# EAGLE design M304B (EAGLE 6.6.0)
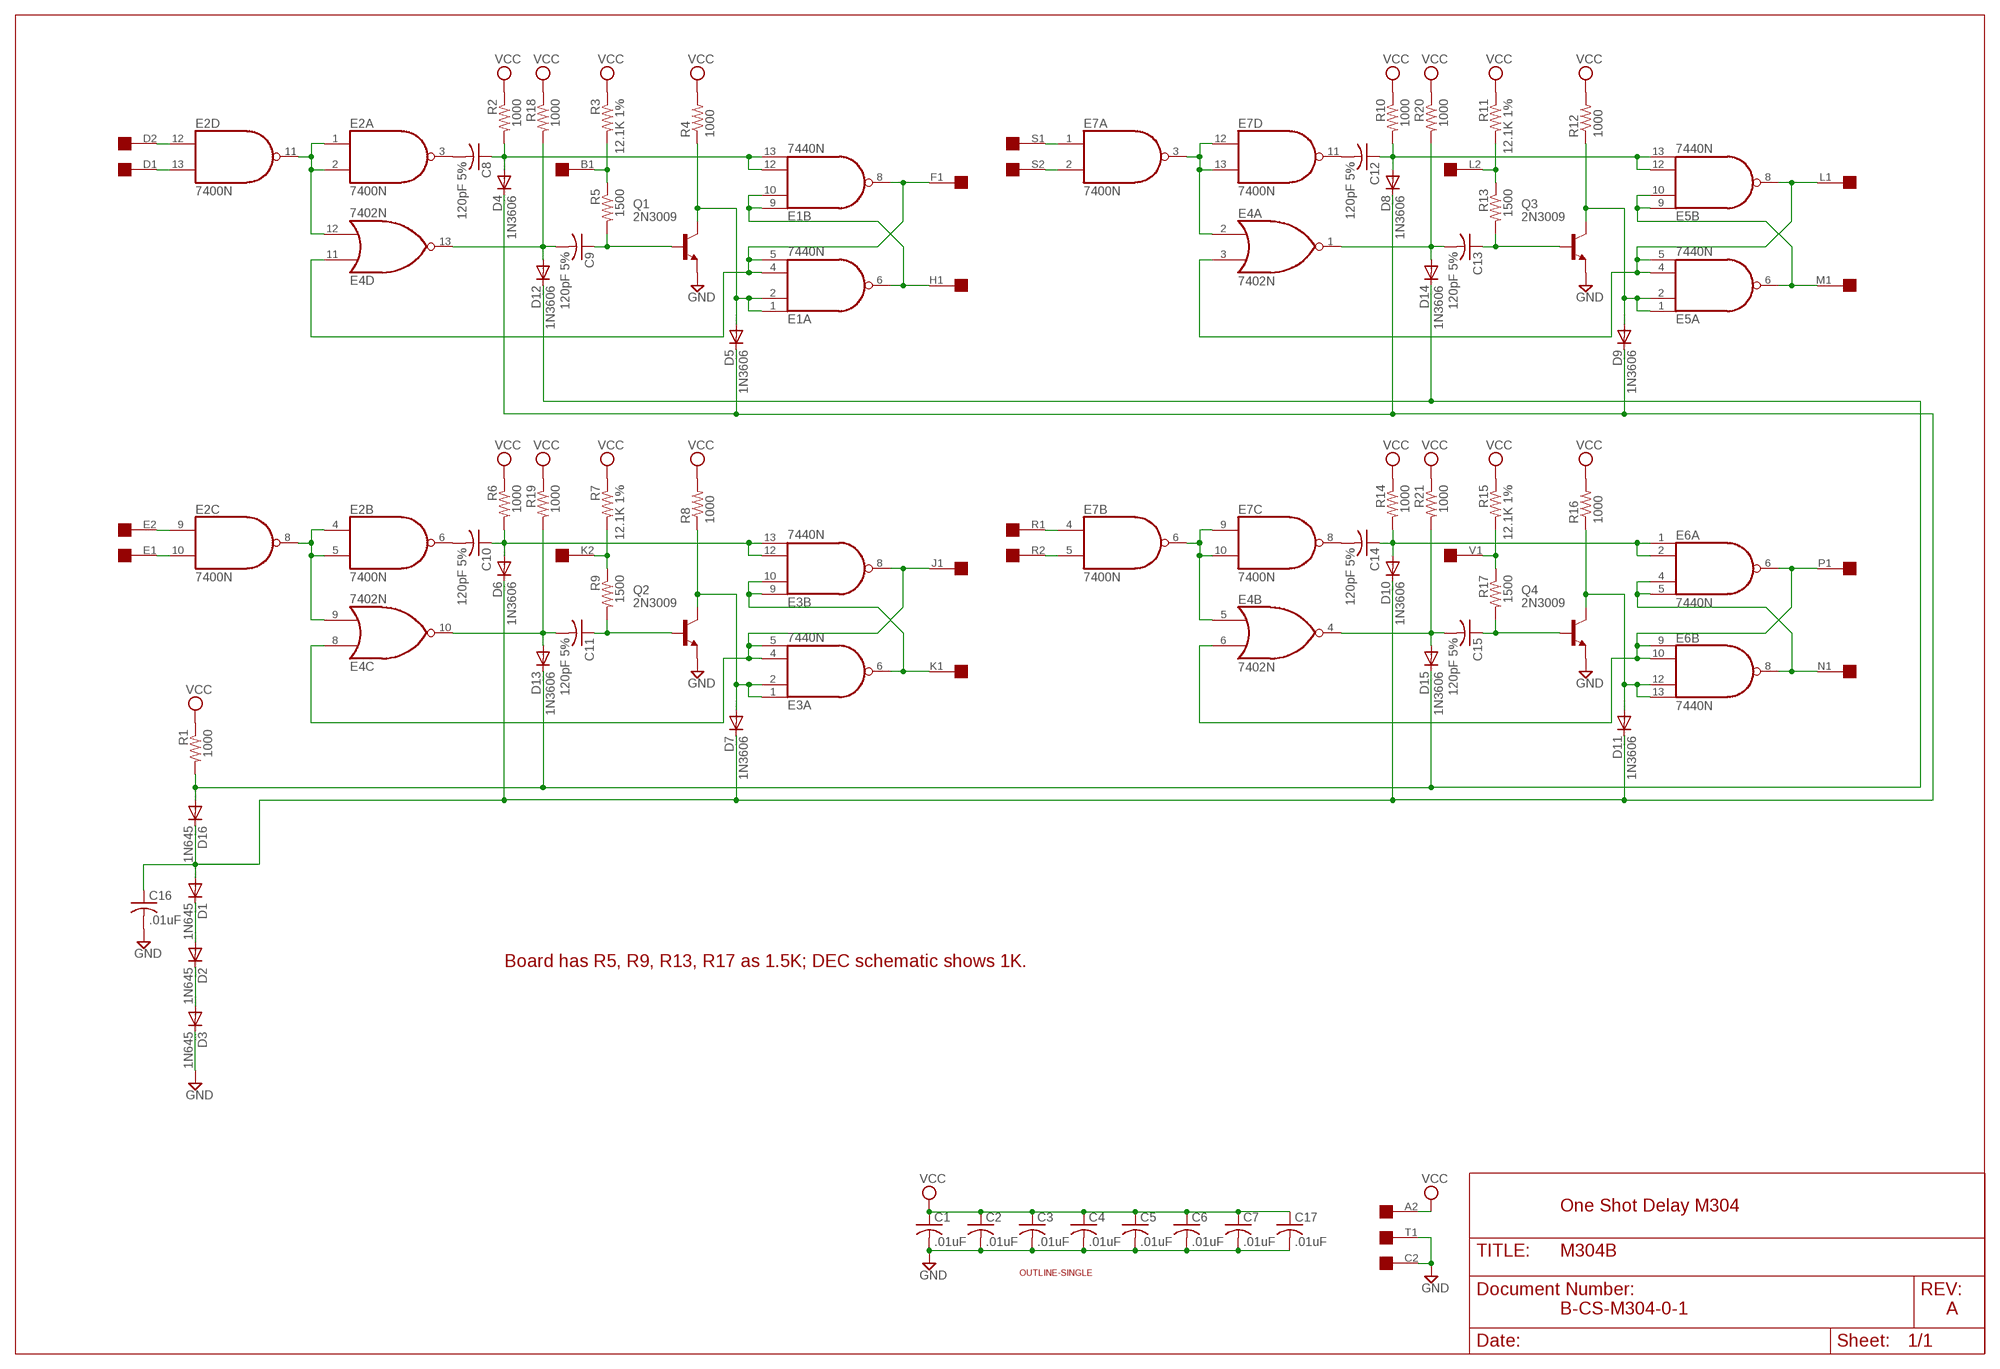
[diagram p0: schematic, sheet 1]

## Parts
C1  .01uF  C-US050-025X075  [C050-025X075]
C2  .01uF  C-US050-025X075  [C050-025X075]
C3  .01uF  C-US050-025X075  [C050-025X075]
C4  .01uF  C-US050-025X075  [C050-025X075]
C5  .01uF  C-US050-025X075  [C050-025X075]
C6  .01uF  C-US050-025X075  [C050-025X075]
C7  .01uF  C-US050-025X075  [C050-025X075]
C8  120pF 5%  C-US050-025X075  [C050-025X075]
C9  120pF 5%  C-US050-025X075  [C050-025X075]
C10  120pF 5%  C-US050-025X075  [C050-025X075]
C11  120pF 5%  C-US050-025X075  [C050-025X075]
C12  120pF 5%  C-US050-025X075  [C050-025X075]
C13  120pF 5%  C-US050-025X075  [C050-025X075]
C14  120pF 5%  C-US050-025X075  [C050-025X075]
C15  120pF 5%  C-US050-025X075  [C050-025X075]
C16  .01uF  C-US050-025X075  [C050-025X075]
C17  .01uF  C-US050-025X075  [C050-025X075]
D1  1N645  1N4148DO35-10  [DO35-10]
D2  1N645  1N4148DO35-10  [DO35-10]
D3  1N645  1N4148DO35-10  [DO35-10]
D4  1N3606  1N4148DO35-10  [DO35-10]
D5  1N3606  1N4148DO35-10  [DO35-10]
D6  1N3606  1N4148DO35-10  [DO35-10]
D7  1N3606  1N4148DO35-10  [DO35-10]
D8  1N3606  1N4148DO35-10  [DO35-10]
D9  1N3606  1N4148DO35-10  [DO35-10]
D10  1N3606  1N4148DO35-10  [DO35-10]
D11  1N3606  1N4148DO35-10  [DO35-10]
D12  1N3606  1N4148DO35-10  [DO35-10]
D13  1N3606  1N4148DO35-10  [DO35-10]
D14  1N3606  1N4148DO35-10  [DO35-10]
D15  1N3606  1N4148DO35-10  [DO35-10]
D16  1N645  1N4148DO35-10  [DO35-10]
E1  7440N  74S20N  [DIL14]
E2  7400N  [DIL14]
E3  7440N  74S20N  [DIL14]
E4  7402N  [DIL14]
E5  7440N  74S20N  [DIL14]
E6  7440N  74S20N  [DIL14]
E7  7400N  [DIL14]
Q1  2N3009  2N3019-NPN-TO39-EBC  [TO39]
Q2  2N3009  2N3019-NPN-TO39-EBC  [TO39]
Q3  2N3009  2N3019-NPN-TO39-EBC  [TO39]
Q4  2N3009  2N3019-NPN-TO39-EBC  [TO39]
R1  1000  R-US_0207/10  [0207/10]
R2  1000  R-US_0207/10  [0207/10]
R3  12.1K 1%  R-US_0207/15  [0207/15]
R4  1000  R-US_0207/10  [0207/10]
R5  1500  R-US_0207/10  [0207/10]
R6  1000  R-US_0207/10  [0207/10]
R7  12.1K 1%  R-US_0207/15  [0207/15]
R8  1000  R-US_0207/10  [0207/10]
R9  1500  R-US_0207/10  [0207/10]
R10  1000  R-US_0207/10  [0207/10]
R11  12.1K 1%  R-US_0207/15  [0207/15]
R12  1000  R-US_0207/10  [0207/10]
R13  1500  R-US_0207/10  [0207/10]
R14  1000  R-US_0207/10  [0207/10]
R15  12.1K 1%  R-US_0207/15  [0207/15]
R16  1000  R-US_0207/10  [0207/10]
R17  1500  R-US_0207/10  [0207/10]
R18  1000  R-US_0207/10  [0207/10]
R19  1000  R-US_0207/10  [0207/10]
R20  1000  R-US_0207/10  [0207/10]
R21  1000  R-US_0207/10  [0207/10]
U$1  SINGLE  [EDGE-CON2]
U$2  OUTLINE-SINGLE  [SINGLE]

## Nets
GND [power]: C1.2 C2.2 C3.2 C4.2 C5.2 C6.2 C7.2 C16.2 C17.2 D3.C Q1.1(E) Q2.1(E) Q3.1(E) Q4.1(E) U$1.C2 U$1.T1
N$1: C16.1 D1.A D4.C D5.C D6.C D7.C D8.C D9.C D10.C D11.C D16.C
N$2: D5.A E1.1(A:I0) E1.2(A:I1) Q1.3(C) R4.1
N$3: E2.1(A:I0) E2.2(A:I1) E2.11(D:O) E4.12(D:I1)
N$4: E2.13(D:I1) U$1.D1
N$5: D1.C D2.A
N$6: E2.12(D:I0) U$1.D2
N$7: C8.2 E2.3(A:O)
N$8: C8.1 D4.A E1.12(B:I2) E1.13(B:I3) R2.2
N$9: D2.C D3.A
N$10: C9.2 D12.A E4.13(D:O) R18.2
N$11: C9.1 Q1.2(B) R5.2
N$12: R3.2 R5.1 U$1.B1
N$13: E1.4(A:I2) E1.5(A:I3) E1.8(B:O) E4.11(D:I0) U$1.F1
N$14: E1.6(A:O) E1.9(B:I0) E1.10(B:I1) U$1.H1
N$16: D12.C D13.C D14.C D15.C D16.A R1.2
N$17: D7.A E3.1(A:I0) E3.2(A:I1) Q2.3(C) R8.1
N$18: E2.4(B:I0) E2.5(B:I1) E2.8(C:O) E4.9(C:I1)
N$19: E2.9(C:I0) U$1.E2
N$20: E2.10(C:I1) U$1.E1
N$21: C10.2 E2.6(B:O)
N$22: C10.1 D6.A E3.12(B:I2) E3.13(B:I3) R6.2
N$23: C11.2 D13.A E4.10(C:O) R19.2
N$24: C11.1 Q2.2(B) R9.2
N$25: R7.2 R9.1 U$1.K2
N$26: E3.4(A:I2) E3.5(A:I3) E3.8(B:O) E4.8(C:I0) U$1.J1
N$27: E3.6(A:O) E3.9(B:I0) E3.10(B:I1) U$1.K1
N$29: D9.A E5.1(A:I0) E5.2(A:I1) Q3.3(C) R12.1
N$30: E4.2(A:I0) E7.3(A:O) E7.12(D:I0) E7.13(D:I1)
N$31: E7.1(A:I0) U$1.S1
N$32: E7.2(A:I1) U$1.S2
N$33: C12.2 E7.11(D:O)
N$34: C12.1 D8.A E5.12(B:I2) E5.13(B:I3) R10.2
N$35: C13.2 D14.A E4.1(A:O) R20.2
N$36: C13.1 Q3.2(B) R13.2
N$37: R11.2 R13.1 U$1.L2
N$38: E4.3(A:I1) E5.4(A:I2) E5.5(A:I3) E5.8(B:O) U$1.L1
N$39: E5.6(A:O) E5.9(B:I0) E5.10(B:I1) U$1.M1
N$41: D11.A E6.12(B:I2) E6.13(B:I3) Q4.3(C) R16.1
N$42: E4.5(B:I0) E7.6(B:O) E7.9(C:I0) E7.10(C:I1)
N$43: E7.4(B:I0) U$1.R1
N$44: E7.5(B:I1) U$1.R2
N$45: C14.2 E7.8(C:O)
N$46: C14.1 D10.A E6.1(A:I0) E6.2(A:I1) R14.2
N$47: C15.2 D15.A E4.4(B:O) R21.2
N$48: C15.1 Q4.2(B) R17.2
N$49: R15.2 R17.1 U$1.V1
N$50: E4.6(B:I1) E6.6(A:O) E6.9(B:I0) E6.10(B:I1) U$1.P1
N$51: E6.4(A:I2) E6.5(A:I3) E6.8(B:O) U$1.N1
VCC [power]: C1.1 C2.1 C3.1 C4.1 C5.1 C6.1 C7.1 C17.1 R1.1 R2.1 R3.1 R4.2 R6.1 R7.1 R8.2 R10.1 R11.1 R12.2 R14.1 R15.1 R16.2 R18.1 R19.1 R20.1 R21.1 U$1.A2
Unconnected: U$1.A1 U$1.B2 U$1.C1 U$1.F2 U$1.H2 U$1.J2 U$1.M2 U$1.N2 U$1.P2 U$1.T2 U$1.U1 U$1.U2 U$1.V2

## Notes on the sheet
- Board has R5, R9, R13, R17 as 1.5K; DEC schematic shows 1K.
- One Shot Delay M304
- B-CS-M304-0-1 | A

## Power pins joined to a net without a drawn wire
GND: E1.7(P:GND) E2.7(P:GND) E3.7(P:GND) E4.7(P:GND) E5.7(P:GND) E6.7(P:GND) E7.7(P:GND)
VCC: E1.14(P:VCC) E2.14(P:VCC) E3.14(P:VCC) E4.14(P:VCC) E5.14(P:VCC) E6.14(P:VCC) E7.14(P:VCC)

## Library data of the parts
C1-C17 = rcl:C-US: CAPACITOR, American symbol
D1-D16 = diode:1N4148: DIODE high speed (Philips)
E1 E3 E5 E6 = 74xx-us:74*20: Dual 4-input NAND gate
E2 E7 = 74xx-us:74*00: Quad 2-input NAND gate
E4 = 74xx-us:74*02: Quad 2-input NOR gate
Q1-Q4 = transistor:*-NPN-: NPN Transistror BF959 corrected 2008.03.06
R1-R21 = rcl:R-US_: RESISTOR, American symbol
U$1 = dec-con:SINGLE: Single-Height DEC board
U$2 = dec-con:OUTLINE-*: Board outlines for DEC boards.

## Net classes
1 power: width 0.813 mm

## Board
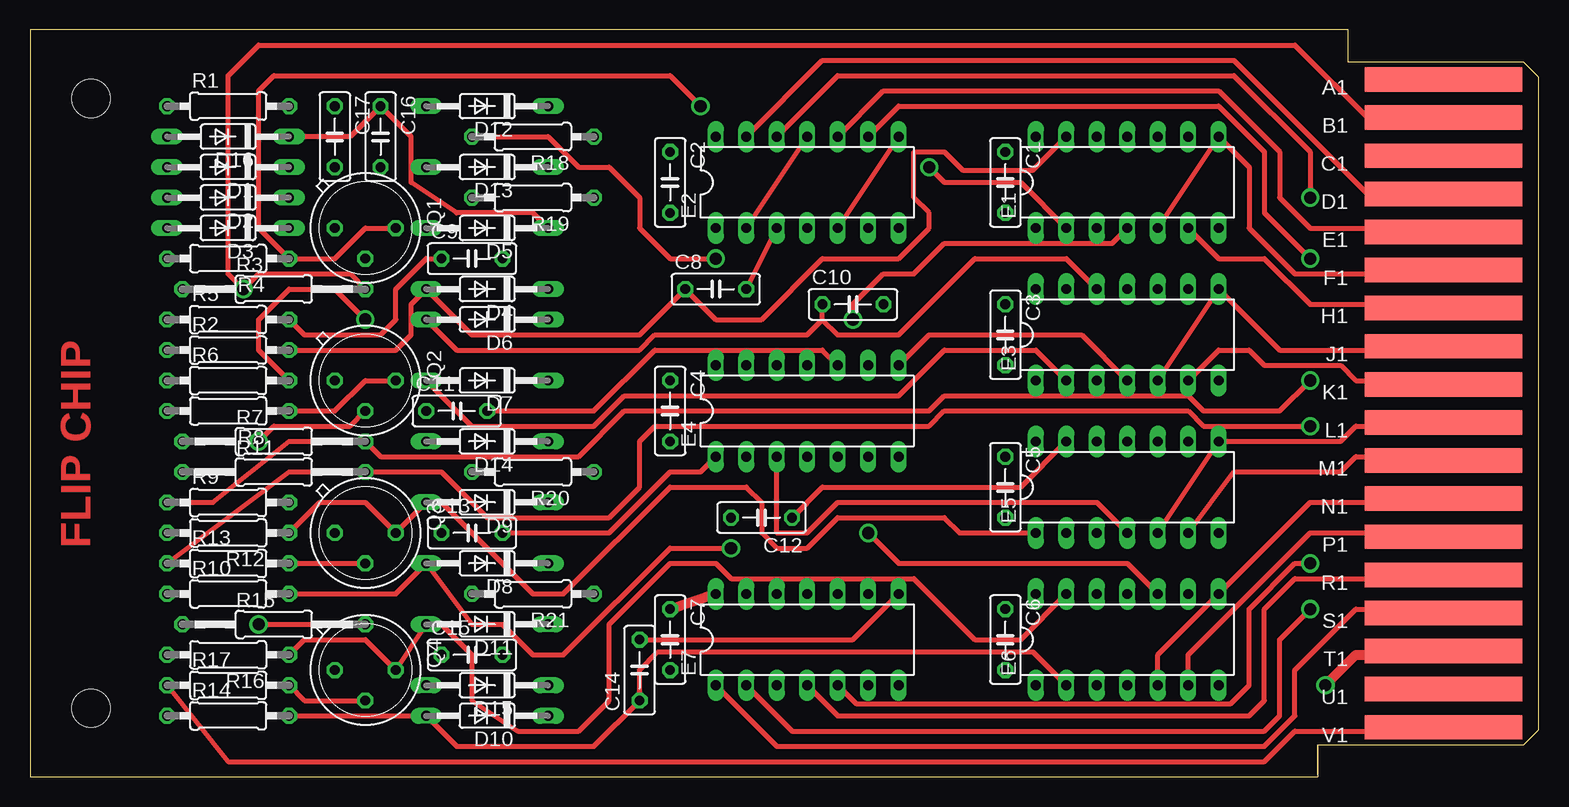
[diagram p1: board, top side]
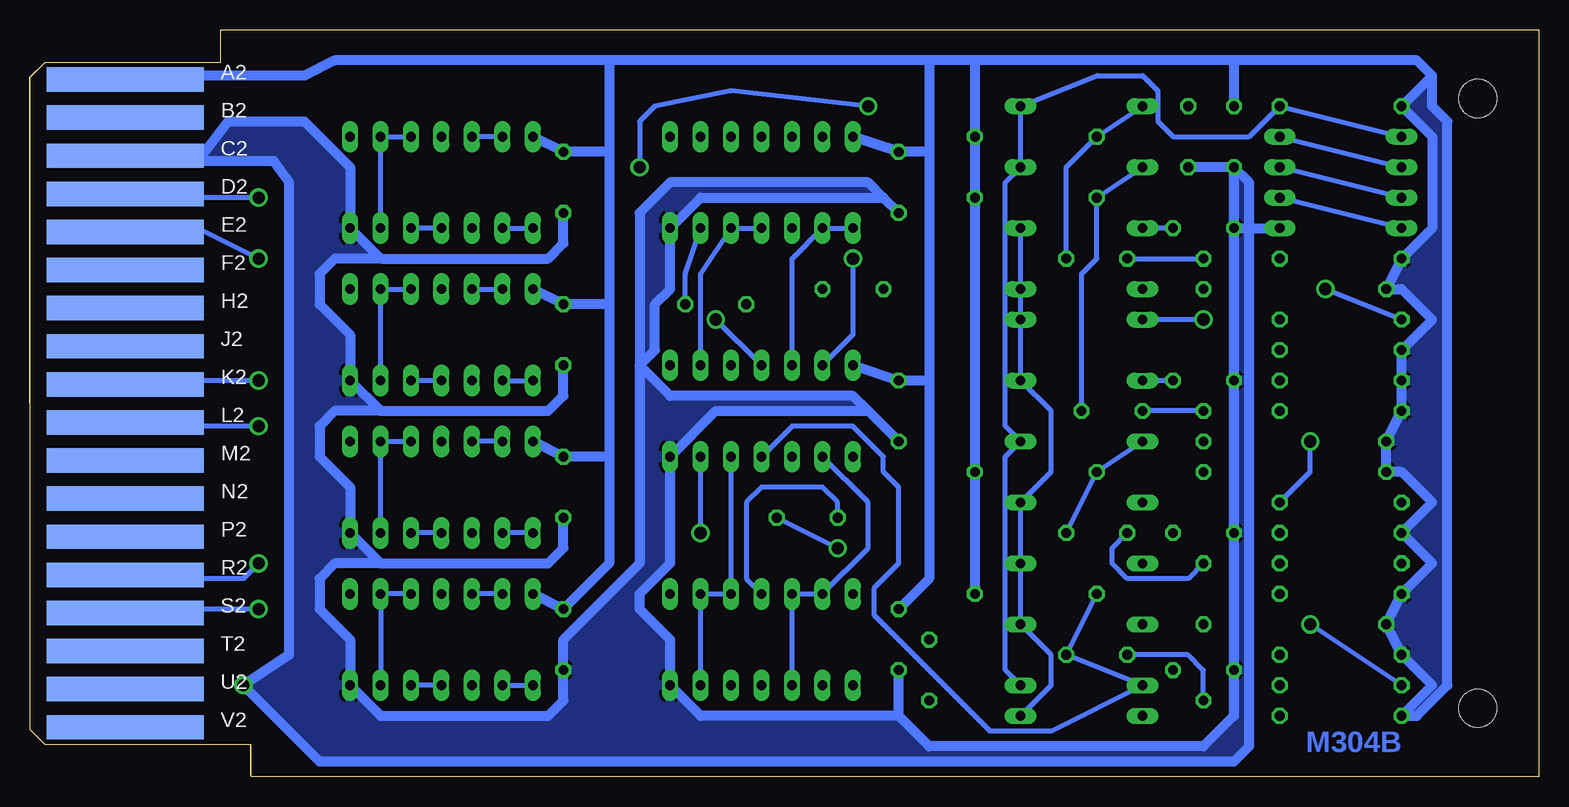
[diagram p2: board, bottom side, seen from below]

Size 125.73 x 62.23 mm. Coordinates in mm from the lower left corner, seen from the top.
Copper layers (1+16): Top 0.035mm / dielectric 1.5mm / Bottom 0.035mm
Design rules "16mils": minimum track width 16mil, minimum drill 32mil, track to track 15mil, track to pad 10mil, pad to pad 10mil, via to via 10mil, smd to smd 10mil, copper to edge 13mil, drill to drill 10mil, minimum pad ring 10mil, minimum via ring 8mil, stop-mask expansion 0mil, vias tented up to drill 0mil, thermal gap 10mil

### Footprints (pad centres in the part's own frame; a part is rotated, then mirrored left to right if it is on the bottom)
C050-025X075 = drill 0.813 octagon: 1 -2.54,0; 2 2.54,0
DO35-10 = drill 0.813 long: A 5.08,0; C -5.08,0
DIL14 = drill 0.813 long: 1 -7.62,-3.81; 2 -5.08,-3.81; 3 -2.54,-3.81; 4 0,-3.81; 5 2.54,-3.81; 6 5.08,-3.81; 7 7.62,-3.81; 8 7.62,3.81; 9 5.08,3.81; 10 2.54,3.81; 11 0,3.81; 12 -2.54,3.81; 13 -5.08,3.81; 14 -7.62,3.81
TO39 = drill 0.813 octagon: 1 0,-2.54; 2 2.54,0; 3 0,2.54
0207/10 = drill 0.813 octagon: 1 -5.08,0; 2 5.08,0
0207/15 = drill 0.813 octagon: 1 -7.62,0; 2 7.62,0
EDGE-CON2 = smd 13.106 x 2.032: A1 7.938,4.128; B1 7.938,7.303; C1 7.938,10.477; D1 7.938,13.652; E1 7.938,16.828; F1 7.938,20.003; H1 7.938,23.177; J1 7.938,26.352; K1 7.938,29.527; L1 7.938,32.703; M1 7.938,35.877; N1 7.938,39.053; P1 7.938,42.227; R1 7.938,45.403; S1 7.938,48.578; T1 7.938,51.752; U1 7.938,54.928; V1 7.938,58.102 | smd 13.106 x 2.032 bottom: A2 7.938,4.128; B2 7.938,7.303; C2 7.938,10.477; D2 7.938,13.652; E2 7.938,16.828; F2 7.938,20.003; H2 7.938,23.177; J2 7.938,26.352; K2 7.938,29.527; L2 7.938,32.703; M2 7.938,35.877; N2 7.938,39.053; P2 7.938,42.227; R2 7.938,45.403; S2 7.938,48.578; T2 7.938,51.752; U2 7.938,54.928; V2 7.938,58.102
SINGLE = hole 3.175: 120.65,56.515; 120.65,5.715

### Placement (x,y rotation side)
C1  81.28,49.53 270 top
C2  53.34,49.53 270 top
C3  81.28,36.83 270 top
C4  53.34,30.48 270 top
C5  81.28,24.13 270 top
C6  81.28,11.43 270 top
C7  53.34,11.43 270 top
C8  57.15,40.64 0 top
C9  36.83,43.18 0 top
C10  68.58,39.37 0 top
C11  35.56,30.48 0 top
C12  60.96,21.59 180 top
C13  36.83,20.32 0 top
C14  50.8,8.89 90 top
C15  36.83,10.16 0 top
C16  29.21,53.34 270 top
C17  25.4,53.34 270 top
D1  16.51,50.8 180 top
D2  16.51,48.26 180 top
D3  16.51,45.72 180 top
D4  38.1,40.64 180 top
D5  38.1,45.72 180 top
D6  38.1,38.1 180 top
D7  38.1,33.02 180 top
D8  38.1,17.78 180 top
D9  38.1,22.86 180 top
D10  38.1,5.08 180 top
D11  38.1,12.7 180 top
D12  38.1,55.88 180 top
D13  38.1,50.8 180 top
D14  38.1,27.94 180 top
D15  38.1,7.62 180 top
D16  16.51,53.34 180 top
E1  91.44,49.53 0 top
E2  64.77,49.53 0 top
E3  91.44,36.83 0 top
E4  64.77,30.48 0 top
E5  91.44,24.13 0 top
E6  91.44,11.43 0 top
E7  64.77,11.43 0 top
Q1  27.94,45.72 270 top
Q2  27.94,33.02 270 top
Q3  27.94,20.32 270 top
Q4  27.94,8.89 270 top
R1  16.51,55.88 0 top
R2  16.51,35.56 0 top
R3  20.32,40.64 0 top
R4  16.51,43.18 180 top
R5  16.51,38.1 0 top
R6  16.51,33.02 0 top
R7  20.32,27.94 0 top
R8  16.51,30.48 180 top
R9  16.51,22.86 0 top
R10  16.51,15.24 0 top
R11  20.32,25.4 0 top
R12  16.51,20.32 180 top
R13  16.51,17.78 0 top
R14  16.51,5.08 0 top
R15  20.32,12.7 0 top
R16  16.51,10.16 180 top
R17  16.51,7.62 0 top
R18  41.91,53.34 180 top
R19  41.91,48.26 180 top
R20  41.91,25.4 180 top
R21  41.91,15.24 180 top
U$1  125.73,62.23 180 top
U$2  125.73,62.23 180 top
U$3  [FLIPCHIP]  0,0 0 top

### Tracks (layer width: path | path; a pad name or v marks a point on that pad's centre or on a via)
GND  (via drill 1.02)
  Top 0.813: U$1.T1 116.84,10.16 111.76,10.16 110.49,10.16 v107.95,7.62
  Bottom 0.813: C17.2 C16.2 | C17.2 Q1.1 | Q1.1 Q2.1 Q3.1 Q4.1 25.4,5.08 27.94,2.54 50.8,2.54 53.34,5.08 | 53.34,5.08 C7.2 | 53.34,5.08 69.85,5.08 E7.7 72.39,11.43 74.93,13.97 74.93,15.24 72.39,17.78 E4.7 68.58,30.48 55.88,30.48 | U$1.C2 116.84,52.07 111.76,51.31 | 111.76,51.31 109.22,54.61 102.87,54.61 99.06,50.8 E1.7 96.52,43.18 | C1.2 81.28,44.45 82.55,43.18 96.52,43.18 | 96.52,43.18 100.33,43.18 101.6,41.91 101.6,39.37 99.06,36.83 E3.7 96.52,30.48 | C3.2 81.28,31.75 82.55,30.48 96.52,30.48 | C5.2 81.28,19.05 82.55,17.78 96.52,17.78 | 96.52,17.78 E5.7 99.06,24.13 101.6,26.67 101.6,29.21 100.33,30.48 96.52,30.48 | 96.52,17.78 100.33,17.78 101.6,16.51 101.6,13.97 99.06,11.43 E6.7 96.52,5.08 82.55,5.08 81.28,6.35 C6.2 81.28,11.43 74.93,17.78 74.93,46.99 72.39,49.53 55.88,49.53 54.61,48.26 | 54.61,48.26 C2.2 | 55.88,30.48 C4.2 | 55.88,30.48 57.15,31.75 72.39,31.75 74.93,34.29 73.66,35.56 73.66,39.37 72.39,40.64 E2.7 69.85,48.26 54.61,48.26 | C17.2 24.13,49.53 24.13,2.54 25.4,1.27 101.6,1.27 v107.95,7.62 104.14,10.16 104.14,49.53 105.41,51.31 111.76,51.31 | Q1.1 D3.C
  pour Bottom (isolate 0.305): 25.4,50.8 24.13,49.53 24.13,2.54 25.4,1.27 101.6,1.27 107.95,7.62 104.14,10.16 104.14,49.53 105.41,51.31 111.76,51.31 109.22,54.61 102.87,54.61 99.06,50.8 99.06,45.72 96.52,43.18 100.33,43.18 101.6,41.91 101.6,39.37 99.06,36.83 99.06,33.02 96.52,30.48 100.33,30.48 101.6,29.21 101.6,26.67 99.06,24.13 99.06,20.32 96.52,17.78 100.33,17.78 101.6,16.51 101.6,13.97 99.06,11.43 99.06,7.62 96.52,5.08 82.55,5.08 81.28,6.35 81.28,11.43 74.93,17.78 74.93,34.29 72.39,31.75 57.15,31.75 55.88,30.48 68.58,30.48 72.39,26.67 72.39,17.78 74.93,15.24 74.93,13.97 72.39,11.43 72.39,7.62 69.85,5.08 53.34,5.08 50.8,2.54 27.94,2.54 25.4,5.08
  pour Bottom (isolate 0.305): 54.61,48.26 55.88,49.53 72.39,49.53 74.93,46.99 74.93,34.29 73.66,35.56 73.66,39.37 72.39,40.64 72.39,45.72 69.85,48.26
N$1
  Top 0.406: D16.C 26.67,53.34 C16.1 31.75,53.34 31.75,49.53 35.56,46.99 41.91,46.99 D5.C
  Bottom 0.406: D16.C D1.A | D10.C 40.64,7.62 40.64,10.16 D11.C D8.C D9.C 40.64,25.4 40.64,30.48 D7.C D6.C D4.C D5.C
N$2  (via drill 1.02)
  Top 0.406: Q1.3 27.94,45.72 25.4,43.18 R4.1 19.05,45.72 19.05,57.15 20.32,58.42 53.34,58.42 v55.88,55.88 | v74.93,50.8 76.2,49.53 82.55,49.53 E1.2
  Bottom 0.406: E1.2 E1.1 | Q1.3 D5.A | v55.88,55.88 67.31,57.15 73.66,55.88 74.93,54.61 v74.93,50.8
N$3
  Top 0.406: E2.2 E2.11
  Bottom 0.406: E2.1 E2.2 62.23,43.18 E4.12
N$4
  Top 0.406: U$1.D1 116.84,48.26 111.76,48.26 100.33,59.69 66.04,59.69 E2.13
N$5
  Bottom 0.406: D2.A D1.C
N$6  (via drill 1.02)
  Top 0.406: v106.68,48.26 106.68,52.07 100.33,58.42 67.31,58.42 E2.12
  Bottom 0.406: U$1.D2 116.84,48.26 v106.68,48.26
N$7
  Top 0.406: C8.2 E2.3
N$8
  Top 0.406: R2.2 30.48,35.56 31.75,36.83 31.75,39.37 D4.A 36.83,36.83 50.8,36.83 C8.1 57.15,38.1 60.96,38.1 66.04,43.18 72.39,43.18 74.93,45.72 74.93,46.99 73.66,48.26 73.66,52.07 76.2,52.07 77.72,50.55 83.57,50.55 E1.13
  Bottom 0.406: E1.13 E1.12
N$9
  Bottom 0.406: D3.A D2.C
N$10  (via drill 1.02)
  Top 0.406: v57.15,43.18 53.34,43.18 50.8,45.72 50.8,48.26 48.26,50.8 45.72,50.8 43.18,53.34 R18.2
  Bottom 0.406: D12.A R18.2 39.37,50.8 C9.2 | E4.13 57.15,36.83 v57.15,43.18
N$11
  Top 0.406: R5.2 22.86,36.83 29.21,36.83 30.48,38.1 30.48,40.64 33.02,43.18 C9.1
  Bottom 0.406: C9.1 Q1.2
N$12  (via drill 1.02)
  Top 0.406: R3.2 26.67,41.91 19.05,41.91 v17.78,40.64 16.51,41.91 16.51,58.42 19.05,60.96 105.41,60.96 111.76,54.61 116.84,54.61 U$1.B1
  Bottom 0.406: R5.1 v17.78,40.64
N$13  (via drill 1.02)
  Top 0.406: E1.5 E1.8 101.6,50.8 101.6,45.72 105.41,41.91 116.84,41.91 U$1.F1 | v68.58,38.1 68.58,39.37 71.12,41.91 73.66,41.91 76.2,44.45 90.17,44.45 E1.4
  Bottom 0.406: E1.4 E1.5 | E4.11 v68.58,38.1
N$14
  Top 0.406: U$1.H1 116.84,39.37 106.68,39.37 102.87,43.18 99.06,43.18 E1.6
  Bottom 0.406: E1.6 E1.9 E1.10
N$16
  Bottom 0.406: D16.A R1.2 24.13,53.34 30.48,53.34 31.75,54.61 31.75,57.15 33.02,58.42 36.83,58.42 D12.C D13.C 44.45,49.53 44.45,29.21 D14.C 44.45,26.67 44.45,8.89 D15.C
N$17
  Top 0.406: R8.1 25.4,30.48 27.94,33.02 Q2.3 | E3.2 83.82,35.56 76.2,35.56 72.39,31.75 49.53,31.75 46.99,29.21 36.83,29.21 D7.A
  Bottom 0.406: E3.2 E3.1 | Q2.3 D7.A
N$18
  Top 0.406: E2.5 E2.8
  Bottom 0.406: E4.9 69.85,41.91 E2.5 E2.4
N$19  (via drill 1.02)
  Top 0.406: v106.68,43.18 102.87,46.99 102.87,52.07 99.06,55.88 72.39,55.88 E2.9
  Bottom 0.406: U$1.E2 115.57,45.72 111.76,45.72 v106.68,43.18
N$20
  Top 0.406: U$1.E1 115.57,45.72 106.68,45.72 104.14,48.26 104.14,52.07 99.06,57.15 71.12,57.15 E2.10
N$21
  Bottom 0.406: E2.6 71.12,41.91 C10.2
N$22  (via drill 1.02)
  Top 0.406: v27.94,38.1 25.4,40.64 21.59,40.64 19.05,38.1 19.05,35.56 R6.2 | E3.12 86.36,43.18 78.74,43.18 72.39,36.83 67.31,36.83 66.04,38.1 | 66.04,38.1 C10.1 | D6.A 35.56,35.56 50.8,35.56 52.07,36.83 64.77,36.83 66.04,38.1
  Bottom 0.406: E3.12 E3.13 | v27.94,38.1 D6.A
N$23
  Top 0.406: E4.10 66.04,35.56 52.07,35.56 46.99,30.48 C11.2
  Bottom 0.406: D13.A R19.2 36.83,43.18 38.1,41.91 C11.2
N$24  (via drill 1.02)
  Top 0.406: v19.05,27.94 20.32,29.21 26.67,29.21 Q2.2
  Bottom 0.406: R9.2 19.05,25.4 v19.05,27.94 | Q2.2 C11.1
N$25  (via drill 1.02)
  Top 0.406: R9.1 15.24,22.86 21.59,27.94 R7.2 29.21,26.67 45.72,26.67 49.53,30.48 74.93,30.48 76.2,31.75 96.52,31.75 97.79,30.48 104.14,30.48 v106.68,33.02
  Bottom 0.406: U$1.K2 116.84,33.02 v106.68,33.02
N$26
  Top 0.406: E3.5 E3.8 104.14,35.56 116.84,35.56 U$1.J1 | E4.8 74.93,36.83 87.63,36.83 E3.4
  Bottom 0.406: E3.4 E3.5
N$27
  Top 0.406: E3.6 99.06,35.56 101.6,35.56 102.87,34.29 109.22,34.29 110.49,33.02 116.84,33.02 U$1.K1
  Bottom 0.406: E3.10 E3.9 E3.6
N$29
  Top 0.406: R12.1 24.13,22.86 27.94,22.86 Q3.3 D9.A 34.29,22.86 41.91,15.24 44.45,15.24 53.34,24.13 59.69,24.13 60.96,22.86 60.96,20.32 62.23,19.05 64.77,19.05 67.31,21.59 76.2,21.59 77.47,20.32 E5.1
  Bottom 0.406: E5.1 E5.2
N$30
  Bottom 0.406: E4.2 55.88,22.86 55.88,19.05 E7.13 E7.12 E7.3
N$31
  Top 0.406: E7.1 62.23,2.54 102.87,2.54 105.41,5.08 105.41,8.89 110.49,13.97 116.84,13.97 U$1.S1
N$32  (via drill 1.02)
  Top 0.406: v106.68,13.97 104.14,11.43 104.14,5.08 102.87,3.81 63.5,3.81 E7.2
  Bottom 0.406: U$1.S2 116.84,13.97 v106.68,13.97
N$33
  Bottom 0.406: C12.2 58.42,22.86 59.69,24.13 64.77,24.13 66.04,22.86 66.04,16.51 E7.11
N$34  (via drill 1.02)
  Top 0.406: R10.2 30.48,15.24 D8.A 36.83,12.7 39.37,12.7 41.91,10.16 44.45,10.16 53.34,19.05 v58.42,19.05 | E5.13 82.55,24.13 66.04,24.13 C12.1
  Bottom 0.406: E5.13 E5.12 | v58.42,19.05 C12.1
N$35
  Top 0.406: E4.1 55.88,25.4 53.34,25.4 48.26,20.32 C13.2
  Bottom 0.406: D14.A R20.2 C13.2
N$36
  Top 0.406: R13.2 Q3.2
  Bottom 0.406: Q3.2 29.21,16.51 34.29,16.51 35.56,17.78 35.56,19.05 C13.1
N$37  (via drill 1.02)
  Top 0.406: R13.1 21.59,25.4 R11.2 34.29,25.4 38.1,21.59 48.26,21.59 50.8,24.13 50.8,27.94 52.07,29.21 74.93,29.21 76.2,30.48 96.52,30.48 97.79,29.21 v106.68,29.21
  Bottom 0.406: U$1.L2 116.84,29.21 v106.68,29.21
N$38
  Top 0.406: E5.5 E5.8 109.22,27.94 110.49,29.21 116.84,29.21 U$1.L1 | E5.4 88.9,22.86 67.31,22.86 64.77,20.32 62.23,20.32 E4.3
  Bottom 0.406: E5.4 E5.5
N$39
  Top 0.406: U$1.M1 116.84,26.67 110.49,26.67 109.22,25.4 100.33,25.4 E5.6
  Bottom 0.406: E5.10 E5.9 E5.6
N$41
  Top 0.406: R16.1 22.86,11.43 27.94,11.43 Q4.3 D11.A 34.29,12.7 36.83,10.16 36.83,6.35 40.64,3.81 45.72,3.81 48.26,6.35 48.26,12.7 53.34,17.78 57.15,17.78 58.42,16.51 73.66,16.51 78.74,11.43 82.55,11.43 E6.13
  Bottom 0.406: E6.13 E6.12
N$42
  Bottom 0.406: E4.5 E7.10 E7.9 E7.6
N$43
  Top 0.406: U$1.R1 116.84,16.51 105.41,16.51 102.87,13.97 102.87,6.35 101.6,5.08 67.31,5.08 E7.4
N$44  (via drill 1.02)
  Top 0.406: E7.5 68.83,6.1 100.08,6.1 101.6,7.62 101.6,13.97 105.41,17.78 v106.68,17.78
  Bottom 0.406: U$1.R2 116.84,16.51 107.95,16.51 v106.68,17.78
N$45
  Top 0.406: C14.2 68.58,11.43 E7.8
N$46
  Top 0.406: R14.2 D10.A 35.56,2.54 46.99,2.54 C14.1 50.8,8.89 52.32,10.41 83.57,10.41 E6.2
  Bottom 0.406: E6.2 E6.1
N$47
  Bottom 0.406: E4.4 62.23,29.21 57.15,29.21 54.61,26.67 54.61,25.4 53.34,24.13 53.34,17.78 55.37,15.75 55.37,13.46 45.72,3.81 40.64,3.81 D15.A C15.2 R21.2
N$48
  Top 0.406: R17.2 22.86,6.35 Q4.2
  Bottom 0.406: C15.1 29.21,10.16 27.94,8.89 Q4.2
N$49  (via drill 1.02)
  Top 0.406: v19.05,12.7 R15.2 | U$1.V1 116.84,3.81 105.41,3.81 102.87,1.27 16.51,1.27 R17.1
  Bottom 0.406: R17.1 v19.05,12.7
N$50  (via drill 1.02)
  Top 0.406: U$1.P1 116.84,20.32 106.68,20.32 96.52,10.16 E6.6 | v69.85,20.32 72.39,17.78 91.44,17.78 E6.10
  Bottom 0.406: E6.10 E6.9 E6.6 | v69.85,20.32 E4.6
N$51
  Top 0.406: E6.5 93.98,10.16 E6.8 106.68,22.86 116.84,22.86 U$1.N1
  Bottom 0.406: E6.4 E6.5
VCC
  Top 0.813: C7.1 E7.14
  Bottom 0.813: 8.89,58.42 R1.1 8.89,53.34 8.89,45.72 R4.2 R3.1 11.43,40.64 8.89,38.1 R2.1 R6.1 R8.2 R7.1 R11.1 11.43,25.4 8.89,22.86 R12.2 8.89,17.78 R10.1 R15.1 R16.2 8.89,7.62 R14.1 10.16,5.08 7.62,7.62 7.62,54.61 8.89,55.88 8.89,58.42 | 25.4,59.69 10.16,59.69 8.89,58.42 | 25.4,59.69 46.99,59.69 | 46.99,59.69 50.8,59.69 | 50.8,59.69 77.47,59.69 | U$1.A2 116.84,58.42 102.87,58.42 100.33,59.69 77.47,59.69 | 25.4,59.69 C17.1 | 46.99,59.69 R18.1 R19.1 R20.1 R21.1 | 50.8,33.02 C4.1 E4.14 | 50.8,59.69 50.8,52.07 | 50.8,52.07 50.8,33.02 | C7.1 50.8,16.51 50.8,33.02 | 50.8,52.07 C2.1 E2.14 | 77.47,59.69 77.47,52.07 | 77.47,52.07 77.47,39.37 | 77.47,39.37 77.47,26.67 | 77.47,26.67 77.47,17.78 C6.1 E6.14 | 77.47,52.07 C1.1 E1.14 | 77.47,39.37 C3.1 E3.14 | 77.47,26.67 C5.1 E5.14
  pour Bottom: 8.89,58.42 11.43,55.88 8.89,53.34 8.89,45.72 11.43,43.18 12.7,40.64 11.43,40.64 8.89,38.1 11.43,35.56 11.43,30.48 12.7,27.94 12.7,25.4 11.43,25.4 8.89,22.86 11.43,20.32 8.89,17.78 11.43,15.24 12.7,12.7 11.43,10.16 8.89,7.62 11.43,5.08 10.16,5.08 7.62,7.62 7.62,54.61 8.89,55.88

### Text on the board
Bottom: M304B